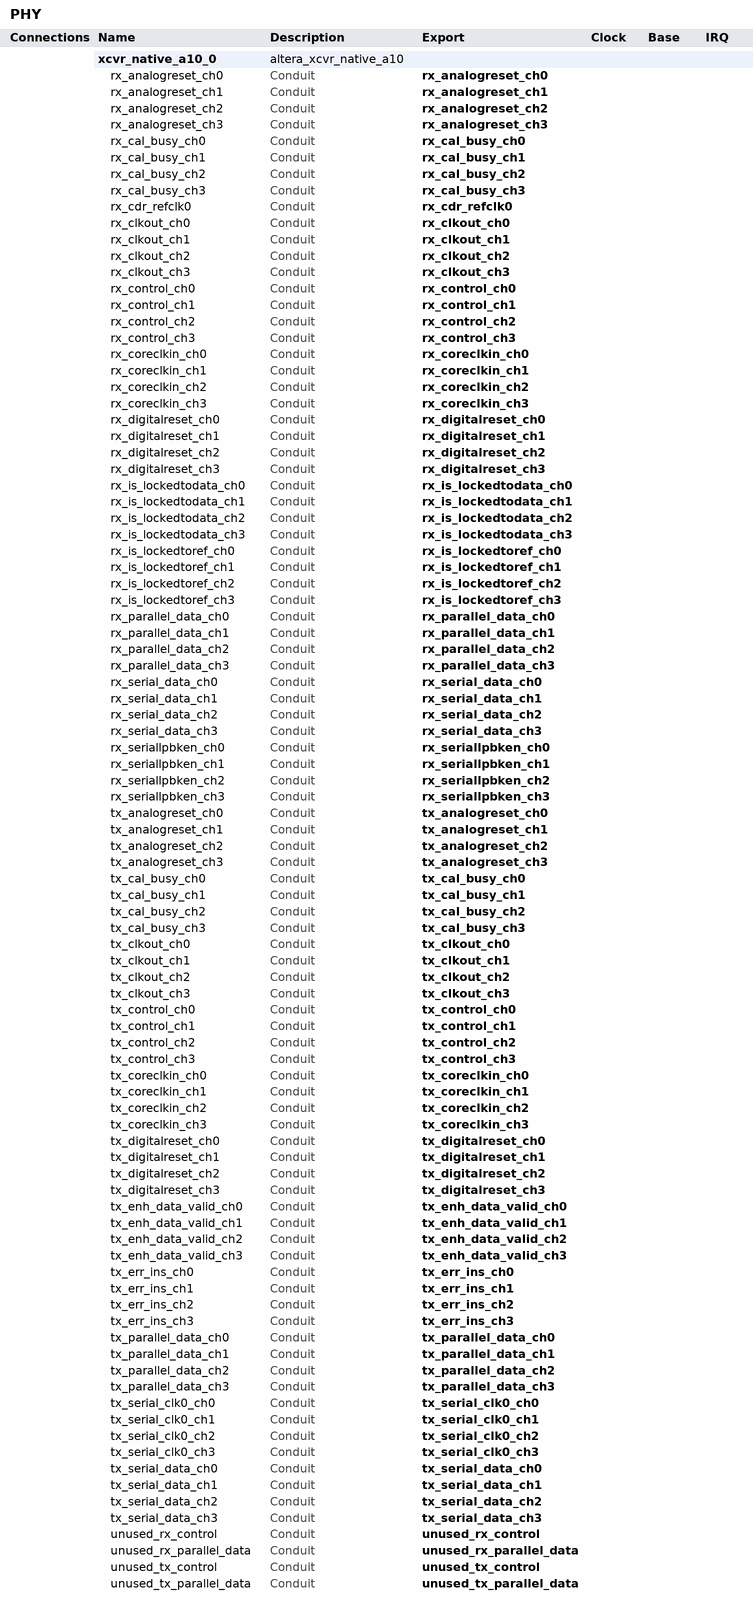
[diagram p0: system contents]
# Platform Designer (Qsys) system PHY, Arria 10 10AX115N2F45E1SG
# Parameters at their usual value, and those the tool derives, are not listed.
package require -exact qsys 17.0
create_system PHY
set_project_property DEVICE_FAMILY {Arria 10}
set_project_property DEVICE 10AX115N2F45E1SG

add_instance xcvr_native_a10_0 altera_xcvr_native_a10 17.0
set_instance_property xcvr_native_a10_0 AUTO_EXPORT true
set_instance_parameter_value xcvr_native_a10_0 anlg_voltage 1_0V
set_instance_parameter_value xcvr_native_a10_0 base_device NIGHTFURY5
set_instance_parameter_value xcvr_native_a10_0 bonded_mode not_bonded
set_instance_parameter_value xcvr_native_a10_0 channels 4
set_instance_parameter_value xcvr_native_a10_0 disable_continuous_dfe false
set_instance_parameter_value xcvr_native_a10_0 enable_pcie_data_mask_option 0
set_instance_parameter_value xcvr_native_a10_0 enable_pcie_dfe_ip false
set_instance_parameter_value xcvr_native_a10_0 enable_port_rx_analog_reset_ack 0
set_instance_parameter_value xcvr_native_a10_0 enable_port_rx_enh_bitslip 0
set_instance_parameter_value xcvr_native_a10_0 enable_port_rx_enh_blk_lock 0
set_instance_parameter_value xcvr_native_a10_0 enable_port_rx_enh_clr_errblk_count 0
set_instance_parameter_value xcvr_native_a10_0 enable_port_rx_enh_data_valid 0
set_instance_parameter_value xcvr_native_a10_0 enable_port_rx_enh_fifo_full 0
set_instance_parameter_value xcvr_native_a10_0 enable_port_rx_enh_fifo_rd_en 0
set_instance_parameter_value xcvr_native_a10_0 enable_port_rx_pma_clkout 0
set_instance_parameter_value xcvr_native_a10_0 enable_port_rx_pma_div_clkout 0
set_instance_parameter_value xcvr_native_a10_0 enable_port_rx_polinv 0
set_instance_parameter_value xcvr_native_a10_0 enable_port_rx_seriallpbken_tx 0
set_instance_parameter_value xcvr_native_a10_0 enable_port_rx_std_bitslip 0
set_instance_parameter_value xcvr_native_a10_0 enable_port_tx_analog_reset_ack 0
set_instance_parameter_value xcvr_native_a10_0 enable_port_tx_enh_fifo_full 0
set_instance_parameter_value xcvr_native_a10_0 enable_port_tx_enh_fifo_pfull 0
set_instance_parameter_value xcvr_native_a10_0 enable_port_tx_pma_clkout 0
set_instance_parameter_value xcvr_native_a10_0 enable_port_tx_pma_div_clkout 0
set_instance_parameter_value xcvr_native_a10_0 enable_port_tx_polinv 0
set_instance_parameter_value xcvr_native_a10_0 enable_ports_rx_manual_cdr_mode 0
set_instance_parameter_value xcvr_native_a10_0 enable_simple_interface 1
set_instance_parameter_value xcvr_native_a10_0 enable_skp_ports 0
set_instance_parameter_value xcvr_native_a10_0 enable_split_interface 1
set_instance_parameter_value xcvr_native_a10_0 enh_pcs_pma_width 64
set_instance_parameter_value xcvr_native_a10_0 enh_pld_pcs_width 66
set_instance_parameter_value xcvr_native_a10_0 enh_rx_64b66b_enable 1
set_instance_parameter_value xcvr_native_a10_0 enh_rx_blksync_enable 1
set_instance_parameter_value xcvr_native_a10_0 enh_rx_descram_enable 1
set_instance_parameter_value xcvr_native_a10_0 enh_rxfifo_mode 10GBase-R
set_instance_parameter_value xcvr_native_a10_0 enh_tx_64b66b_enable 1
set_instance_parameter_value xcvr_native_a10_0 enh_tx_scram_enable 1
set_instance_parameter_value xcvr_native_a10_0 enh_tx_scram_seed 288230376151711743
set_instance_parameter_value xcvr_native_a10_0 enh_txfifo_mode {Phase compensation}
set_instance_parameter_value xcvr_native_a10_0 generate_add_hdl_instance_example 0
set_instance_parameter_value xcvr_native_a10_0 generate_docs 0
set_instance_parameter_value xcvr_native_a10_0 protocol_mode teng_baser_mode
set_instance_parameter_value xcvr_native_a10_0 rcfg_enable 0
set_instance_parameter_value xcvr_native_a10_0 rcfg_file_prefix altera_xcvr_native_a10
set_instance_parameter_value xcvr_native_a10_0 rcfg_h_file_enable 0
set_instance_parameter_value xcvr_native_a10_0 rcfg_iface_enable 0
set_instance_parameter_value xcvr_native_a10_0 rcfg_jtag_enable 0
set_instance_parameter_value xcvr_native_a10_0 rcfg_mif_file_enable 0
set_instance_parameter_value xcvr_native_a10_0 rcfg_multi_enable 0
set_instance_parameter_value xcvr_native_a10_0 rcfg_profile_cnt 2
set_instance_parameter_value xcvr_native_a10_0 rcfg_profile_select 1
set_instance_parameter_value xcvr_native_a10_0 rcfg_reduced_files_enable 0
set_instance_parameter_value xcvr_native_a10_0 rcfg_separate_avmm_busy 0
set_instance_parameter_value xcvr_native_a10_0 rcfg_shared 0
set_instance_parameter_value xcvr_native_a10_0 rcfg_sv_file_enable 0
set_instance_parameter_value xcvr_native_a10_0 rx_pma_div_clkout_divider 0
set_instance_parameter_value xcvr_native_a10_0 set_capability_reg_enable 0
set_instance_parameter_value xcvr_native_a10_0 set_cdr_refclk_freq 644.531250
set_instance_parameter_value xcvr_native_a10_0 set_csr_soft_logic_enable 0
set_instance_parameter_value xcvr_native_a10_0 set_data_rate 10312.5
set_instance_parameter_value xcvr_native_a10_0 set_disconnect_analog_resets 0
set_instance_parameter_value xcvr_native_a10_0 set_odi_soft_logic_enable 0
set_instance_parameter_value xcvr_native_a10_0 set_prbs_soft_logic_enable 0
set_instance_parameter_value xcvr_native_a10_0 sim_reduced_counters false
set_instance_parameter_value xcvr_native_a10_0 std_data_mask_count_multi 0
set_instance_parameter_value xcvr_native_a10_0 std_pcs_pma_width 20
set_instance_parameter_value xcvr_native_a10_0 std_rx_8b10b_enable 1
set_instance_parameter_value xcvr_native_a10_0 std_rx_byte_deser_mode Disabled
set_instance_parameter_value xcvr_native_a10_0 std_rx_polinv_enable 0
set_instance_parameter_value xcvr_native_a10_0 std_rx_word_aligner_mode {synchronous state machine}
set_instance_parameter_value xcvr_native_a10_0 std_rx_word_aligner_pattern 643
set_instance_parameter_value xcvr_native_a10_0 std_rx_word_aligner_pattern_len 10
set_instance_parameter_value xcvr_native_a10_0 std_tx_8b10b_enable 1
set_instance_parameter_value xcvr_native_a10_0 std_tx_byte_ser_mode Disabled
set_instance_parameter_value xcvr_native_a10_0 std_tx_polinv_enable 0
set_instance_parameter_value xcvr_native_a10_0 tx_pma_div_clkout_divider 0

# exported interfaces
add_interface rx_analogreset_ch0 conduit end
set_interface_property rx_analogreset_ch0 EXPORT_OF xcvr_native_a10_0.rx_analogreset_ch0
add_interface rx_analogreset_ch1 conduit end
set_interface_property rx_analogreset_ch1 EXPORT_OF xcvr_native_a10_0.rx_analogreset_ch1
add_interface rx_analogreset_ch2 conduit end
set_interface_property rx_analogreset_ch2 EXPORT_OF xcvr_native_a10_0.rx_analogreset_ch2
add_interface rx_analogreset_ch3 conduit end
set_interface_property rx_analogreset_ch3 EXPORT_OF xcvr_native_a10_0.rx_analogreset_ch3
add_interface rx_cal_busy_ch0 conduit end
set_interface_property rx_cal_busy_ch0 EXPORT_OF xcvr_native_a10_0.rx_cal_busy_ch0
add_interface rx_cal_busy_ch1 conduit end
set_interface_property rx_cal_busy_ch1 EXPORT_OF xcvr_native_a10_0.rx_cal_busy_ch1
add_interface rx_cal_busy_ch2 conduit end
set_interface_property rx_cal_busy_ch2 EXPORT_OF xcvr_native_a10_0.rx_cal_busy_ch2
add_interface rx_cal_busy_ch3 conduit end
set_interface_property rx_cal_busy_ch3 EXPORT_OF xcvr_native_a10_0.rx_cal_busy_ch3
add_interface rx_cdr_refclk0 conduit end
set_interface_property rx_cdr_refclk0 EXPORT_OF xcvr_native_a10_0.rx_cdr_refclk0
add_interface rx_clkout_ch0 conduit end
set_interface_property rx_clkout_ch0 EXPORT_OF xcvr_native_a10_0.rx_clkout_ch0
add_interface rx_clkout_ch1 conduit end
set_interface_property rx_clkout_ch1 EXPORT_OF xcvr_native_a10_0.rx_clkout_ch1
add_interface rx_clkout_ch2 conduit end
set_interface_property rx_clkout_ch2 EXPORT_OF xcvr_native_a10_0.rx_clkout_ch2
add_interface rx_clkout_ch3 conduit end
set_interface_property rx_clkout_ch3 EXPORT_OF xcvr_native_a10_0.rx_clkout_ch3
add_interface rx_control_ch0 conduit end
set_interface_property rx_control_ch0 EXPORT_OF xcvr_native_a10_0.rx_control_ch0
add_interface rx_control_ch1 conduit end
set_interface_property rx_control_ch1 EXPORT_OF xcvr_native_a10_0.rx_control_ch1
add_interface rx_control_ch2 conduit end
set_interface_property rx_control_ch2 EXPORT_OF xcvr_native_a10_0.rx_control_ch2
add_interface rx_control_ch3 conduit end
set_interface_property rx_control_ch3 EXPORT_OF xcvr_native_a10_0.rx_control_ch3
add_interface rx_coreclkin_ch0 conduit end
set_interface_property rx_coreclkin_ch0 EXPORT_OF xcvr_native_a10_0.rx_coreclkin_ch0
add_interface rx_coreclkin_ch1 conduit end
set_interface_property rx_coreclkin_ch1 EXPORT_OF xcvr_native_a10_0.rx_coreclkin_ch1
add_interface rx_coreclkin_ch2 conduit end
set_interface_property rx_coreclkin_ch2 EXPORT_OF xcvr_native_a10_0.rx_coreclkin_ch2
add_interface rx_coreclkin_ch3 conduit end
set_interface_property rx_coreclkin_ch3 EXPORT_OF xcvr_native_a10_0.rx_coreclkin_ch3
add_interface rx_digitalreset_ch0 conduit end
set_interface_property rx_digitalreset_ch0 EXPORT_OF xcvr_native_a10_0.rx_digitalreset_ch0
add_interface rx_digitalreset_ch1 conduit end
set_interface_property rx_digitalreset_ch1 EXPORT_OF xcvr_native_a10_0.rx_digitalreset_ch1
add_interface rx_digitalreset_ch2 conduit end
set_interface_property rx_digitalreset_ch2 EXPORT_OF xcvr_native_a10_0.rx_digitalreset_ch2
add_interface rx_digitalreset_ch3 conduit end
set_interface_property rx_digitalreset_ch3 EXPORT_OF xcvr_native_a10_0.rx_digitalreset_ch3
add_interface rx_is_lockedtodata_ch0 conduit end
set_interface_property rx_is_lockedtodata_ch0 EXPORT_OF xcvr_native_a10_0.rx_is_lockedtodata_ch0
add_interface rx_is_lockedtodata_ch1 conduit end
set_interface_property rx_is_lockedtodata_ch1 EXPORT_OF xcvr_native_a10_0.rx_is_lockedtodata_ch1
add_interface rx_is_lockedtodata_ch2 conduit end
set_interface_property rx_is_lockedtodata_ch2 EXPORT_OF xcvr_native_a10_0.rx_is_lockedtodata_ch2
add_interface rx_is_lockedtodata_ch3 conduit end
set_interface_property rx_is_lockedtodata_ch3 EXPORT_OF xcvr_native_a10_0.rx_is_lockedtodata_ch3
add_interface rx_is_lockedtoref_ch0 conduit end
set_interface_property rx_is_lockedtoref_ch0 EXPORT_OF xcvr_native_a10_0.rx_is_lockedtoref_ch0
add_interface rx_is_lockedtoref_ch1 conduit end
set_interface_property rx_is_lockedtoref_ch1 EXPORT_OF xcvr_native_a10_0.rx_is_lockedtoref_ch1
add_interface rx_is_lockedtoref_ch2 conduit end
set_interface_property rx_is_lockedtoref_ch2 EXPORT_OF xcvr_native_a10_0.rx_is_lockedtoref_ch2
add_interface rx_is_lockedtoref_ch3 conduit end
set_interface_property rx_is_lockedtoref_ch3 EXPORT_OF xcvr_native_a10_0.rx_is_lockedtoref_ch3
add_interface rx_parallel_data_ch0 conduit end
set_interface_property rx_parallel_data_ch0 EXPORT_OF xcvr_native_a10_0.rx_parallel_data_ch0
add_interface rx_parallel_data_ch1 conduit end
set_interface_property rx_parallel_data_ch1 EXPORT_OF xcvr_native_a10_0.rx_parallel_data_ch1
add_interface rx_parallel_data_ch2 conduit end
set_interface_property rx_parallel_data_ch2 EXPORT_OF xcvr_native_a10_0.rx_parallel_data_ch2
add_interface rx_parallel_data_ch3 conduit end
set_interface_property rx_parallel_data_ch3 EXPORT_OF xcvr_native_a10_0.rx_parallel_data_ch3
add_interface rx_serial_data_ch0 conduit end
set_interface_property rx_serial_data_ch0 EXPORT_OF xcvr_native_a10_0.rx_serial_data_ch0
add_interface rx_serial_data_ch1 conduit end
set_interface_property rx_serial_data_ch1 EXPORT_OF xcvr_native_a10_0.rx_serial_data_ch1
add_interface rx_serial_data_ch2 conduit end
set_interface_property rx_serial_data_ch2 EXPORT_OF xcvr_native_a10_0.rx_serial_data_ch2
add_interface rx_serial_data_ch3 conduit end
set_interface_property rx_serial_data_ch3 EXPORT_OF xcvr_native_a10_0.rx_serial_data_ch3
add_interface rx_seriallpbken_ch0 conduit end
set_interface_property rx_seriallpbken_ch0 EXPORT_OF xcvr_native_a10_0.rx_seriallpbken_ch0
add_interface rx_seriallpbken_ch1 conduit end
set_interface_property rx_seriallpbken_ch1 EXPORT_OF xcvr_native_a10_0.rx_seriallpbken_ch1
add_interface rx_seriallpbken_ch2 conduit end
set_interface_property rx_seriallpbken_ch2 EXPORT_OF xcvr_native_a10_0.rx_seriallpbken_ch2
add_interface rx_seriallpbken_ch3 conduit end
set_interface_property rx_seriallpbken_ch3 EXPORT_OF xcvr_native_a10_0.rx_seriallpbken_ch3
add_interface tx_analogreset_ch0 conduit end
set_interface_property tx_analogreset_ch0 EXPORT_OF xcvr_native_a10_0.tx_analogreset_ch0
add_interface tx_analogreset_ch1 conduit end
set_interface_property tx_analogreset_ch1 EXPORT_OF xcvr_native_a10_0.tx_analogreset_ch1
add_interface tx_analogreset_ch2 conduit end
set_interface_property tx_analogreset_ch2 EXPORT_OF xcvr_native_a10_0.tx_analogreset_ch2
add_interface tx_analogreset_ch3 conduit end
set_interface_property tx_analogreset_ch3 EXPORT_OF xcvr_native_a10_0.tx_analogreset_ch3
add_interface tx_cal_busy_ch0 conduit end
set_interface_property tx_cal_busy_ch0 EXPORT_OF xcvr_native_a10_0.tx_cal_busy_ch0
add_interface tx_cal_busy_ch1 conduit end
set_interface_property tx_cal_busy_ch1 EXPORT_OF xcvr_native_a10_0.tx_cal_busy_ch1
add_interface tx_cal_busy_ch2 conduit end
set_interface_property tx_cal_busy_ch2 EXPORT_OF xcvr_native_a10_0.tx_cal_busy_ch2
add_interface tx_cal_busy_ch3 conduit end
set_interface_property tx_cal_busy_ch3 EXPORT_OF xcvr_native_a10_0.tx_cal_busy_ch3
add_interface tx_clkout_ch0 conduit end
set_interface_property tx_clkout_ch0 EXPORT_OF xcvr_native_a10_0.tx_clkout_ch0
add_interface tx_clkout_ch1 conduit end
set_interface_property tx_clkout_ch1 EXPORT_OF xcvr_native_a10_0.tx_clkout_ch1
add_interface tx_clkout_ch2 conduit end
set_interface_property tx_clkout_ch2 EXPORT_OF xcvr_native_a10_0.tx_clkout_ch2
add_interface tx_clkout_ch3 conduit end
set_interface_property tx_clkout_ch3 EXPORT_OF xcvr_native_a10_0.tx_clkout_ch3
add_interface tx_control_ch0 conduit end
set_interface_property tx_control_ch0 EXPORT_OF xcvr_native_a10_0.tx_control_ch0
add_interface tx_control_ch1 conduit end
set_interface_property tx_control_ch1 EXPORT_OF xcvr_native_a10_0.tx_control_ch1
add_interface tx_control_ch2 conduit end
set_interface_property tx_control_ch2 EXPORT_OF xcvr_native_a10_0.tx_control_ch2
add_interface tx_control_ch3 conduit end
set_interface_property tx_control_ch3 EXPORT_OF xcvr_native_a10_0.tx_control_ch3
add_interface tx_coreclkin_ch0 conduit end
set_interface_property tx_coreclkin_ch0 EXPORT_OF xcvr_native_a10_0.tx_coreclkin_ch0
add_interface tx_coreclkin_ch1 conduit end
set_interface_property tx_coreclkin_ch1 EXPORT_OF xcvr_native_a10_0.tx_coreclkin_ch1
add_interface tx_coreclkin_ch2 conduit end
set_interface_property tx_coreclkin_ch2 EXPORT_OF xcvr_native_a10_0.tx_coreclkin_ch2
add_interface tx_coreclkin_ch3 conduit end
set_interface_property tx_coreclkin_ch3 EXPORT_OF xcvr_native_a10_0.tx_coreclkin_ch3
add_interface tx_digitalreset_ch0 conduit end
set_interface_property tx_digitalreset_ch0 EXPORT_OF xcvr_native_a10_0.tx_digitalreset_ch0
add_interface tx_digitalreset_ch1 conduit end
set_interface_property tx_digitalreset_ch1 EXPORT_OF xcvr_native_a10_0.tx_digitalreset_ch1
add_interface tx_digitalreset_ch2 conduit end
set_interface_property tx_digitalreset_ch2 EXPORT_OF xcvr_native_a10_0.tx_digitalreset_ch2
add_interface tx_digitalreset_ch3 conduit end
set_interface_property tx_digitalreset_ch3 EXPORT_OF xcvr_native_a10_0.tx_digitalreset_ch3
add_interface tx_enh_data_valid_ch0 conduit end
set_interface_property tx_enh_data_valid_ch0 EXPORT_OF xcvr_native_a10_0.tx_enh_data_valid_ch0
add_interface tx_enh_data_valid_ch1 conduit end
set_interface_property tx_enh_data_valid_ch1 EXPORT_OF xcvr_native_a10_0.tx_enh_data_valid_ch1
add_interface tx_enh_data_valid_ch2 conduit end
set_interface_property tx_enh_data_valid_ch2 EXPORT_OF xcvr_native_a10_0.tx_enh_data_valid_ch2
add_interface tx_enh_data_valid_ch3 conduit end
set_interface_property tx_enh_data_valid_ch3 EXPORT_OF xcvr_native_a10_0.tx_enh_data_valid_ch3
add_interface tx_err_ins_ch0 conduit end
set_interface_property tx_err_ins_ch0 EXPORT_OF xcvr_native_a10_0.tx_err_ins_ch0
add_interface tx_err_ins_ch1 conduit end
set_interface_property tx_err_ins_ch1 EXPORT_OF xcvr_native_a10_0.tx_err_ins_ch1
add_interface tx_err_ins_ch2 conduit end
set_interface_property tx_err_ins_ch2 EXPORT_OF xcvr_native_a10_0.tx_err_ins_ch2
add_interface tx_err_ins_ch3 conduit end
set_interface_property tx_err_ins_ch3 EXPORT_OF xcvr_native_a10_0.tx_err_ins_ch3
add_interface tx_parallel_data_ch0 conduit end
set_interface_property tx_parallel_data_ch0 EXPORT_OF xcvr_native_a10_0.tx_parallel_data_ch0
add_interface tx_parallel_data_ch1 conduit end
set_interface_property tx_parallel_data_ch1 EXPORT_OF xcvr_native_a10_0.tx_parallel_data_ch1
add_interface tx_parallel_data_ch2 conduit end
set_interface_property tx_parallel_data_ch2 EXPORT_OF xcvr_native_a10_0.tx_parallel_data_ch2
add_interface tx_parallel_data_ch3 conduit end
set_interface_property tx_parallel_data_ch3 EXPORT_OF xcvr_native_a10_0.tx_parallel_data_ch3
add_interface tx_serial_clk0_ch0 conduit end
set_interface_property tx_serial_clk0_ch0 EXPORT_OF xcvr_native_a10_0.tx_serial_clk0_ch0
add_interface tx_serial_clk0_ch1 conduit end
set_interface_property tx_serial_clk0_ch1 EXPORT_OF xcvr_native_a10_0.tx_serial_clk0_ch1
add_interface tx_serial_clk0_ch2 conduit end
set_interface_property tx_serial_clk0_ch2 EXPORT_OF xcvr_native_a10_0.tx_serial_clk0_ch2
add_interface tx_serial_clk0_ch3 conduit end
set_interface_property tx_serial_clk0_ch3 EXPORT_OF xcvr_native_a10_0.tx_serial_clk0_ch3
add_interface tx_serial_data_ch0 conduit end
set_interface_property tx_serial_data_ch0 EXPORT_OF xcvr_native_a10_0.tx_serial_data_ch0
add_interface tx_serial_data_ch1 conduit end
set_interface_property tx_serial_data_ch1 EXPORT_OF xcvr_native_a10_0.tx_serial_data_ch1
add_interface tx_serial_data_ch2 conduit end
set_interface_property tx_serial_data_ch2 EXPORT_OF xcvr_native_a10_0.tx_serial_data_ch2
add_interface tx_serial_data_ch3 conduit end
set_interface_property tx_serial_data_ch3 EXPORT_OF xcvr_native_a10_0.tx_serial_data_ch3
add_interface unused_rx_control conduit end
set_interface_property unused_rx_control EXPORT_OF xcvr_native_a10_0.unused_rx_control
add_interface unused_rx_parallel_data conduit end
set_interface_property unused_rx_parallel_data EXPORT_OF xcvr_native_a10_0.unused_rx_parallel_data
add_interface unused_tx_control conduit end
set_interface_property unused_tx_control EXPORT_OF xcvr_native_a10_0.unused_tx_control
add_interface unused_tx_parallel_data conduit end
set_interface_property unused_tx_parallel_data EXPORT_OF xcvr_native_a10_0.unused_tx_parallel_data

set_interconnect_requirement {$system} qsys_mm.clockCrossingAdapter HANDSHAKE
set_interconnect_requirement {$system} qsys_mm.enableEccProtection FALSE
set_interconnect_requirement {$system} qsys_mm.insertDefaultSlave FALSE
set_interconnect_requirement {$system} qsys_mm.maxAdditionalLatency 1

save_system PHY.qsys
